# EAGLE design realParking (EAGLE 6.5.0)
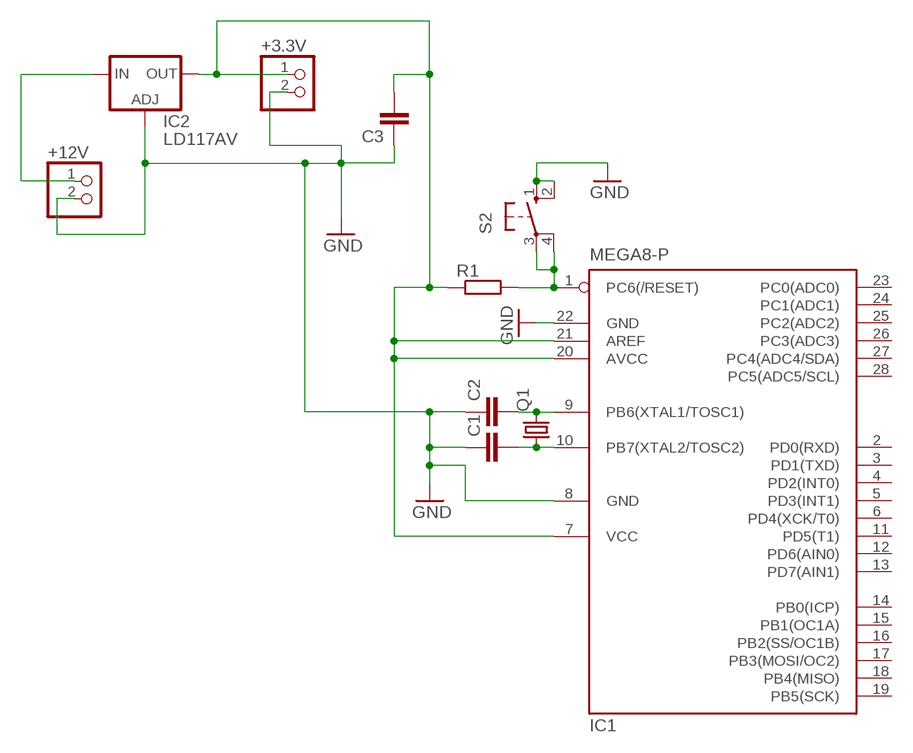
[diagram p0: schematic, sheet 1]

## Parts
+3.3V  PINHD-1X2  [1X02]
+12V  PINHD-1X2  [1X02]
C1  C2,5-3  [C2.5-3]
C2  C2,5-3  [C2.5-3]
C3  C2,5-3  [C2.5-3]
IC1  MEGA8-P  [DIL28-3]
IC2  LD117AV  [TO220L1]
Q1  CRYSTALTC26V  [TC26V]
R1  R-EU_0204/5  [0204/5]
S2  10-XX  [B3F-10XX]

## Nets
3.3V: +3.3V.1 C3.2 IC1.7(VCC) IC1.20(AVCC) IC1.21(AREF) IC2.2(OUT) R1.1
GND: +3.3V.2 +12V.2 C1.1 C2.1 C3.1 IC1.8(GND) IC1.22(GND) IC2.1(ADJ) S2.1(S) S2.2(S1)
N$2: +12V.1 IC2.3(IN)
N$14: C2.2 IC1.9(PB6(XTAL1/TOSC1)) Q1.2
N$15: C1.2 IC1.10(PB7(XTAL2/TOSC2)) Q1.1
N$16: IC1.1(PC6(/RESET)) R1.2 S2.3(P) S2.4(P1)
Unconnected: IC1.2(PD0(RXD)) IC1.3(PD1(TXD)) IC1.4(PD2(INT0)) IC1.5(PD3(INT1)) IC1.6(PD4(XCK/T0)) IC1.11(PD5(T1)) IC1.12(PD6(AIN0)) IC1.13(PD7(AIN1)) IC1.14(PB0(ICP)) IC1.15(PB1(OC1A)) IC1.16(PB2(SS/OC1B)) IC1.17(PB3(MOSI/OC2)) IC1.18(PB4(MISO)) IC1.19(PB5(SCK)) IC1.23(PC0(ADC0)) IC1.24(PC1(ADC1)) IC1.25(PC2(ADC2)) IC1.26(PC3(ADC3)) IC1.27(PC4(ADC4/SDA)) IC1.28(PC5(ADC5/SCL))

## Library data of the parts
+3.3V +12V = pinhead:PINHD-1X2: PIN HEADER
C1-C3 = capacitor-wima:C: CAPACITOR naming: grid - package width
IC1 = atmel:MEGA8-P: MICROCONTROLLER 8 Kbytes FLASH, 1 kbytes SRAM, 512 bytes EEPROM, USART, 4-channel 10 bit ADC, 2-channel 8 bit ADC Pin compatible with Atmega48, ATMega88, ATMega168 Source: avr.lbr; OC_FARNELL: unknown; OC_NEWARK: unknown
IC2 = v-reg:LD117A?*: Low drop fixed and adjustable positive voltage regulators 1 A Source: http://www.st.com/stonline/products/literature/ds/7194/ld1117axx.pdf
Q1 = crystal:CRYSTAL: CRYSTAL; OC_FARNELL: unknown; OC_NEWARK: unknown
R1 = rcl:R-EU_: RESISTOR, European symbol
S2 = switch-omron:10-XX: OMRON SWITCH; MPN: B3F-1000; OC_FARNELL: 176432; OC_NEWARK: 36M3542

## Board
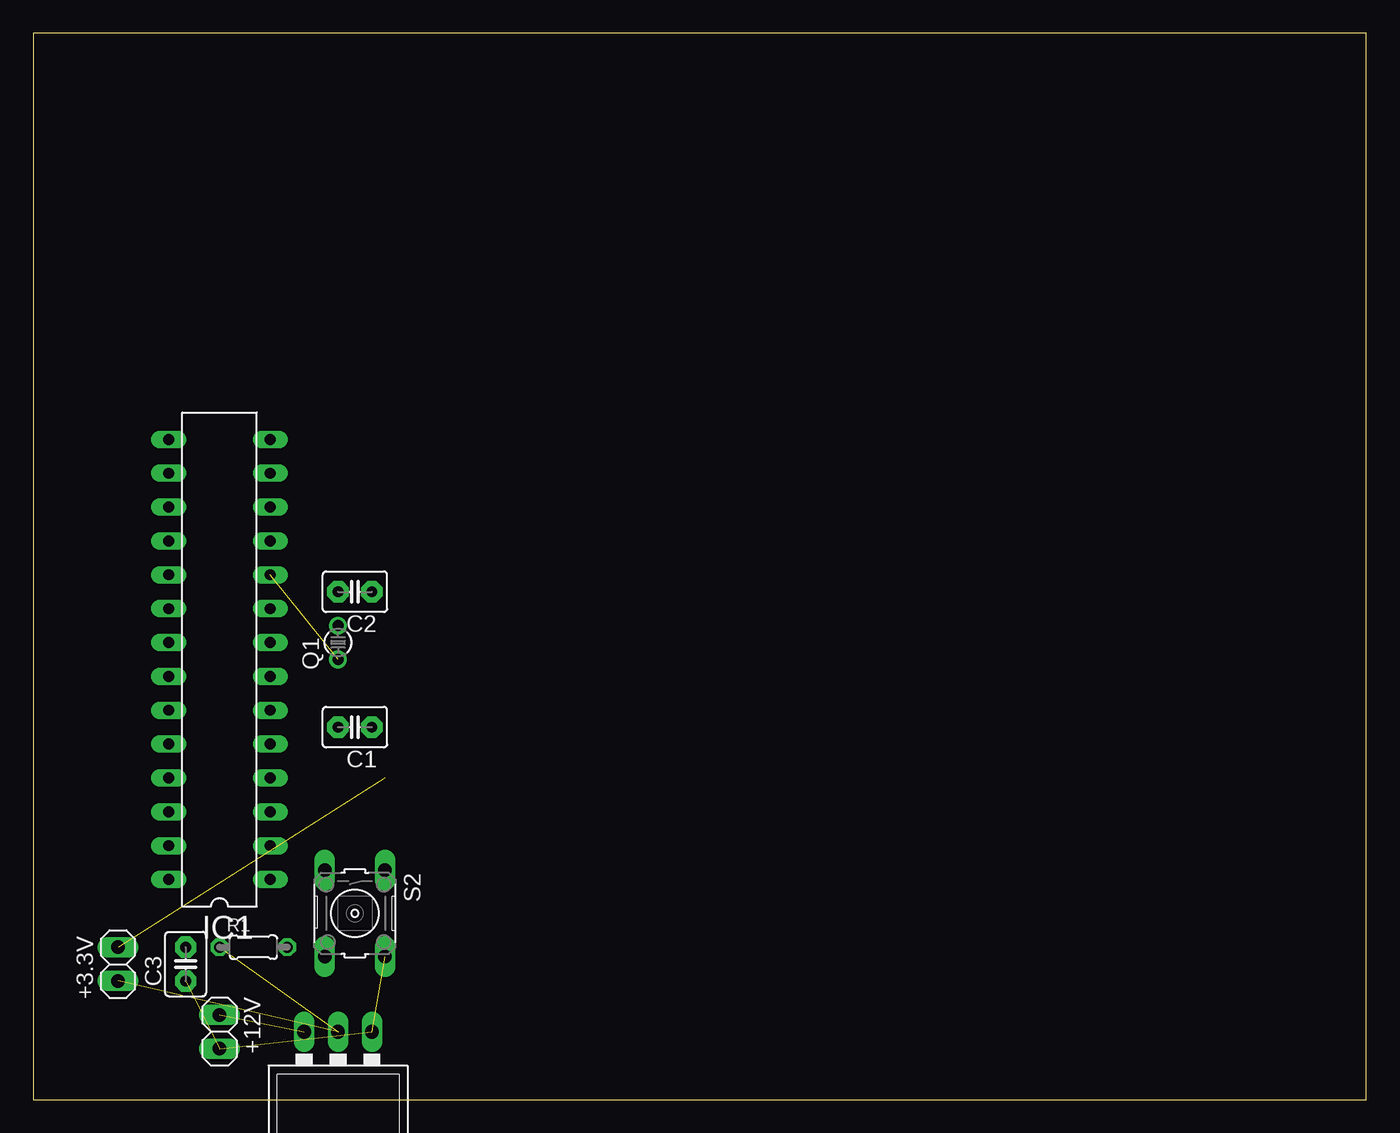
[diagram p1: board, top side]
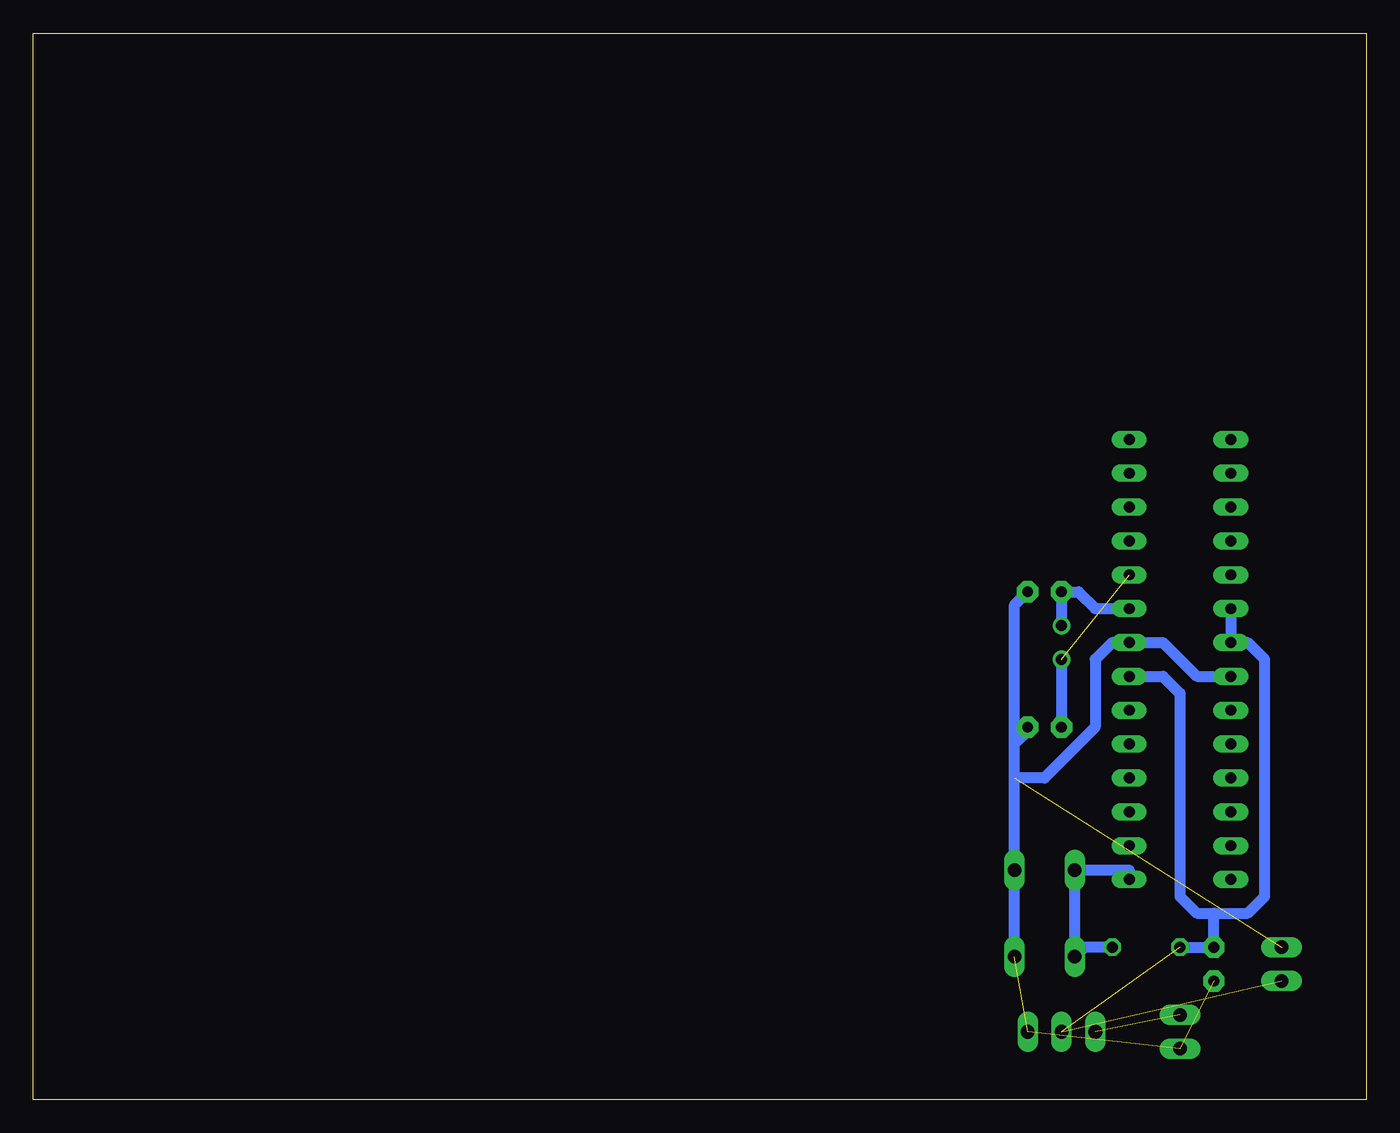
[diagram p2: board, bottom side, seen from below]

Size 100 x 80 mm. Coordinates in mm from the lower left corner, seen from the top.
Outline: 0,0 100,0 100,80 0,80 0,0
Copper layers (1*16): Top 0.035mm / dielectric 1.5mm / Bottom 0.035mm
Design rules "default": minimum track width 10mil, minimum drill 24mil, track to track 8mil, track to pad 8mil, pad to pad 8mil, via to via 8mil, smd to smd 8mil, copper to edge 40mil, drill to drill 8mil, minimum pad ring 10mil, minimum via ring 8mil, stop-mask expansion 4mil, vias tented up to drill 0mil, thermal gap 10mil

### Footprints (pad centres in the part's own frame; a part is rotated, then mirrored left to right if it is on the bottom)
1X02 = drill 1.016 long: 1 -1.27,0; 2 1.27,0
C2.5-3 = drill 0.813 pad 1.6 octagon: 1 -1.27,0; 2 1.27,0
DIL28-3 = drill 0.813 long: 1 -16.51,-3.81; 2 -13.97,-3.81; 3 -11.43,-3.81; 4 -8.89,-3.81; 5 -6.35,-3.81; 6 -3.81,-3.81; 7 -1.27,-3.81; 8 1.27,-3.81; 9 3.81,-3.81; 10 6.35,-3.81; 11 8.89,-3.81; 12 11.43,-3.81; 13 13.97,-3.81; 14 16.51,-3.81; 15 16.51,3.81; 16 13.97,3.81; 17 11.43,3.81; 18 8.89,3.81; 19 6.35,3.81; 20 3.81,3.81; 21 1.27,3.81; 22 -1.27,3.81; 23 -3.81,3.81; 24 -6.35,3.81; 25 -8.89,3.81; 26 -11.43,3.81; 27 -13.97,3.81; 28 -16.51,3.81
TO220L1 = drill 1.016 long: 1 -2.54,-3.81; 2 0,-3.81; 3 2.54,-3.81 | hole 3.302: 0,11.176
TC26V = drill 0.813: 1 -1.27,0; 2 1.27,0
0204/5 = drill 0.813 octagon: 1 -2.54,0; 2 2.54,0
B3F-10XX = drill 1.016 long: 1 -3.251,2.261; 2 3.251,2.261; 3 -3.251,-2.261; 4 3.251,-2.261

### Placement (x,y rotation side)
+3.3V  6.35,10.16 90 top
+12V  13.97,5.08 270 top
C1  24.13,27.94 180 top
C2  24.13,38.1 180 top
C3  11.43,10.16 90 top
IC1  13.97,33.02 90 top
IC2  22.86,1.27 180 top
Q1  22.86,34.29 90 top
R1  16.51,11.43 0 top
S2  24.13,13.97 270 top

### Tracks (layer width: path | path; a pad name or v marks a point on that pad's centre or on a via)
3.3V  (2 unrouted)
  Bottom 0.813: IC1.20 IC1.21 8.89,34.29 7.62,33.02 7.62,15.24 8.89,13.97 11.43,13.97 | IC1.7 15.24,31.75 13.97,30.48 13.97,15.24 12.7,13.97 11.43,13.97 | 11.43,13.97 C3.2 R1.1
GND  (4 unrouted)
  Bottom 0.813: S2.2 S2.1 26.39,24.13 | 26.39,24.13 26.39,26.67 | 26.39,26.67 26.39,37.11 C2.1 | C1.1 25.4,27.66 26.39,26.67 | 26.39,24.13 24.13,24.13 20.32,27.94 20.32,33.02 19.05,34.29 IC1.8 15.24,34.29 12.7,31.75 IC1.22
N$2  (1 unrouted)
N$14
  Bottom 0.813: Q1.2 C2.2 21.59,38.1 20.32,36.83 IC1.9
N$15  (1 unrouted)
  Bottom 0.813: Q1.1 C1.2
N$16
  Bottom 0.813: IC1.1 17.78,17.22 S2.3 S2.4 21.16,11.43 R1.2